# EasyEDA Pro project 超级电小鹅EDAv0.1.epro

# Schematic 超级电小鹅
Board Name: stm32桌面宠物最新板二合一; Create Date: 2025-02-21; Page Name: P1; Project Name: STM32智能桌面宠物; Schematic Name: 超级电小鹅; Update Date: 2025-02-21; Company: 嘉立创EDA; Drawed: SPICY_NOODLES; Page Size: A4; Version: V1.0
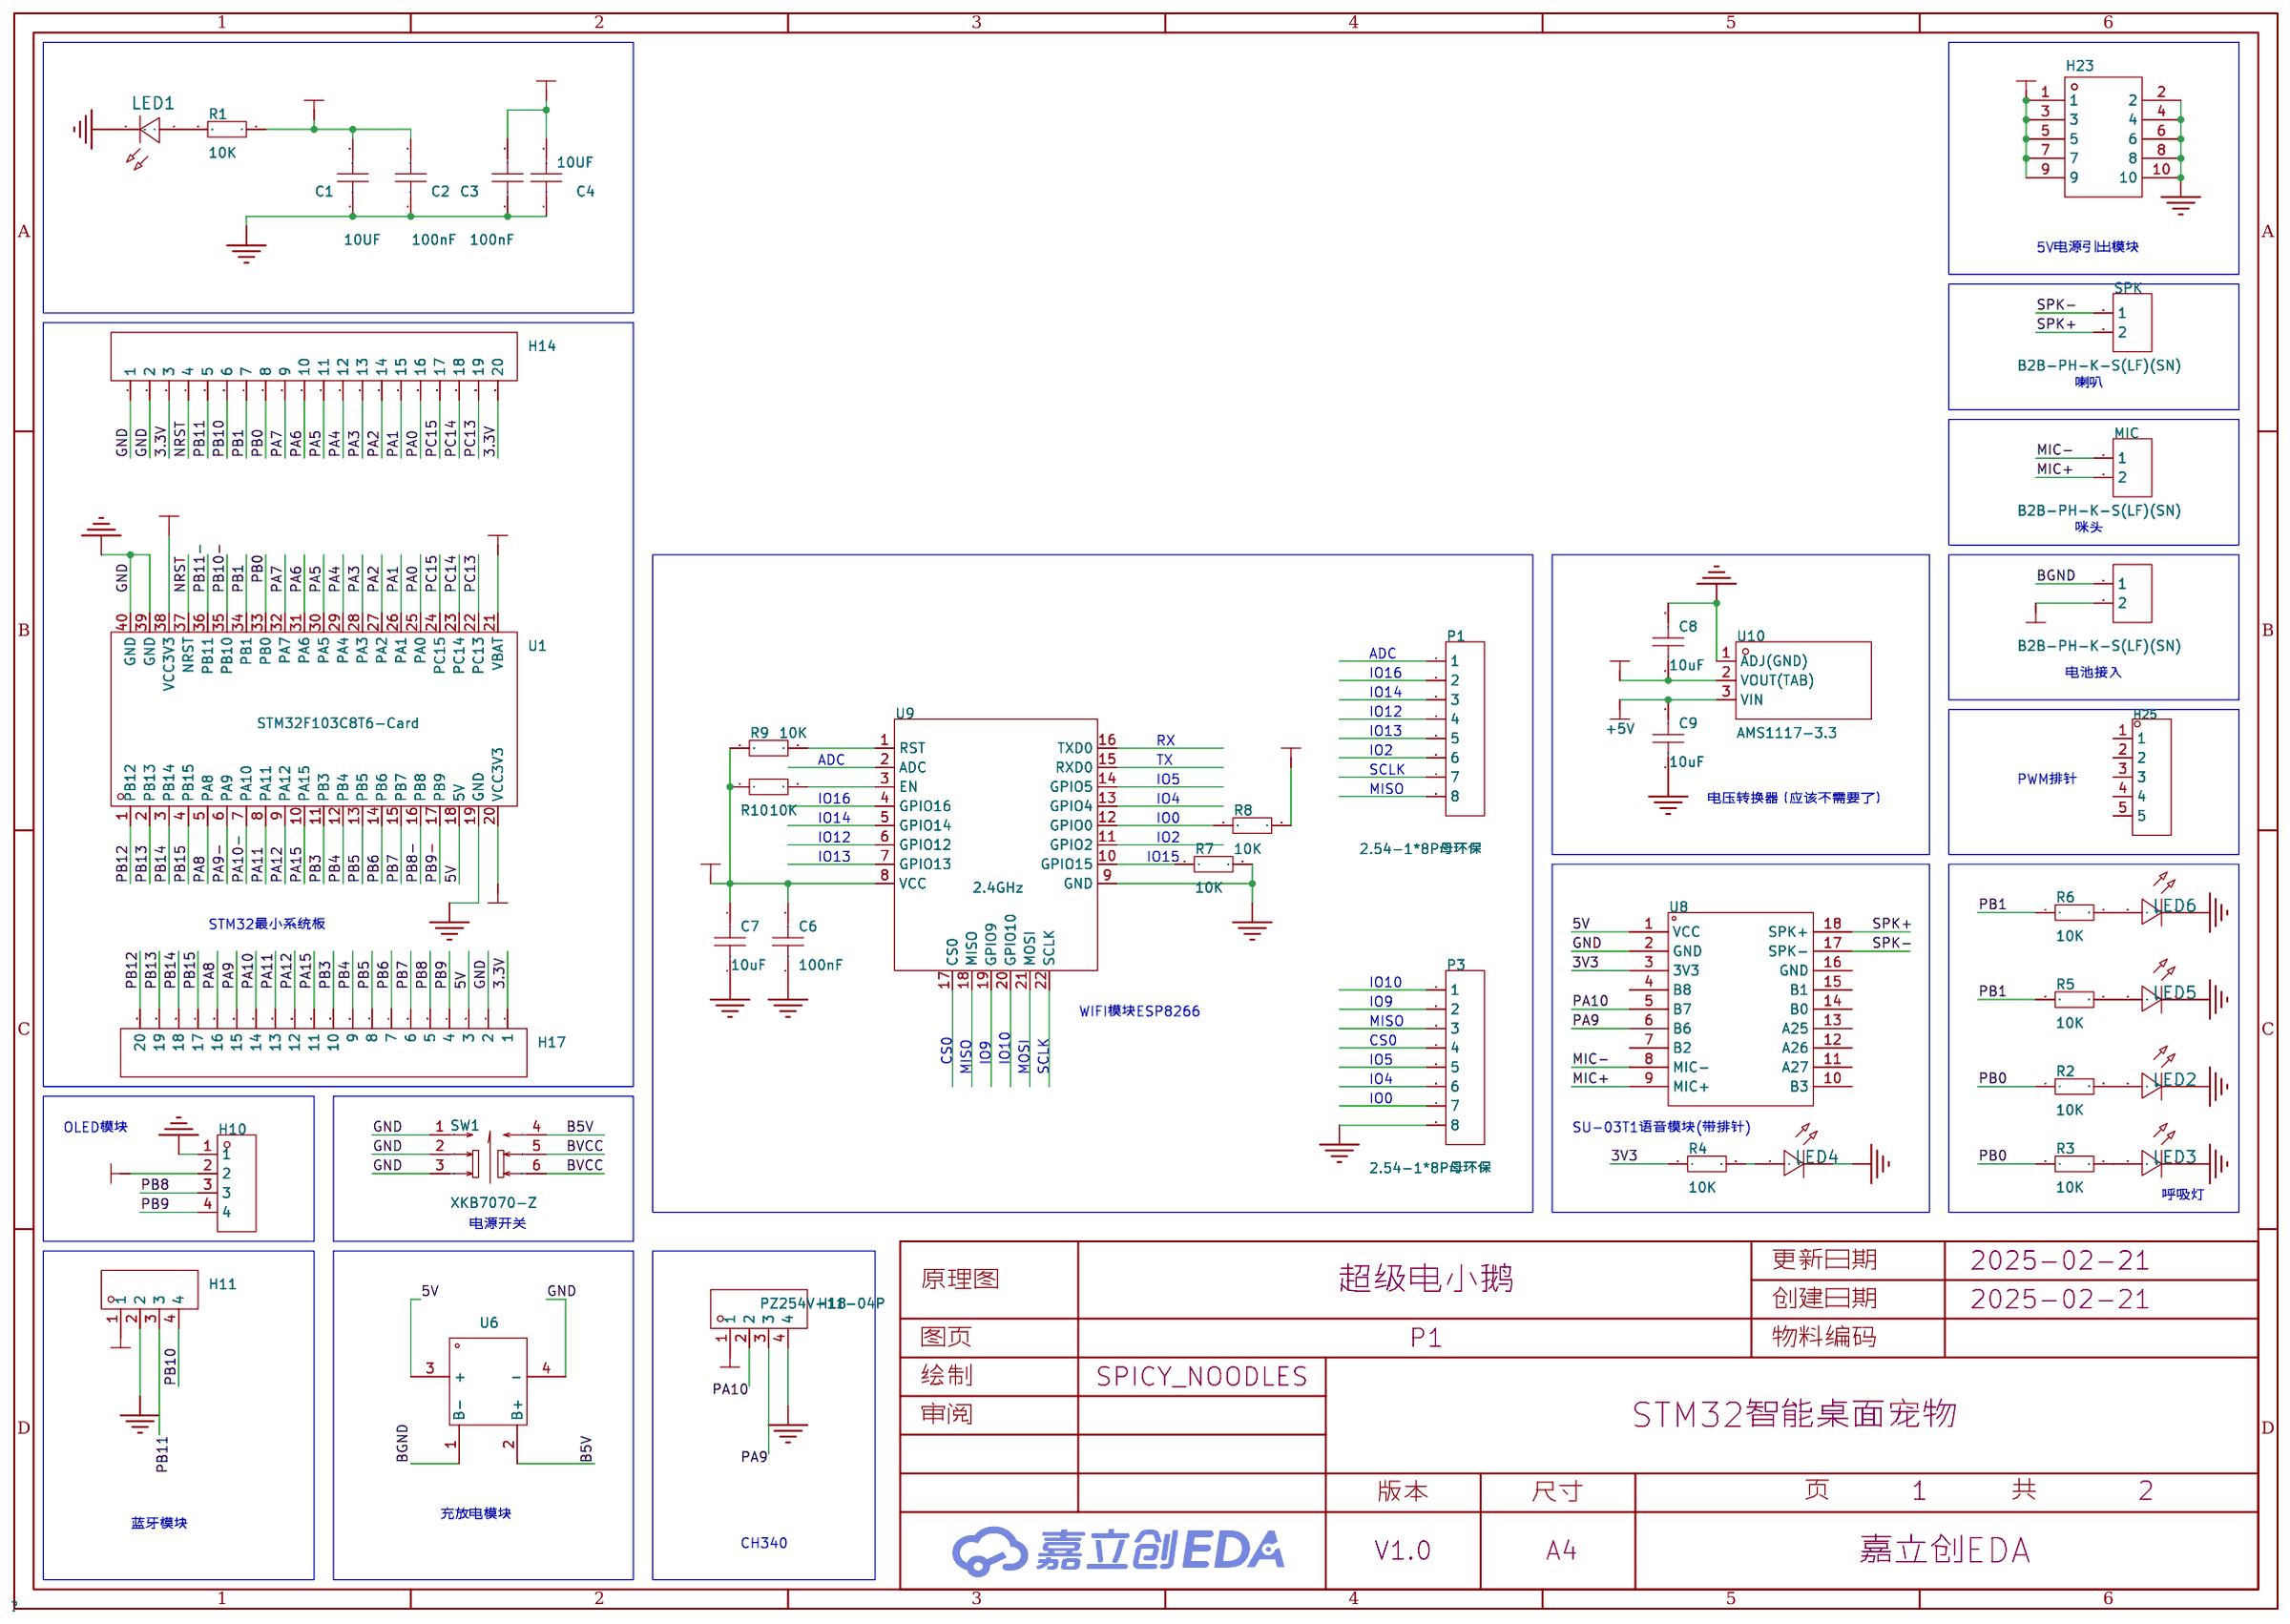
[diagram p0: schematic sheet]

## Parts
Battery  B2B-PH-K-S(LF)(SN)  [CONN-TH_B2B-PH-K-S]
C1  10UF  [C0805]
C2  100nF  [C0805]
C3  100nF  [C0805]
C4  10UF  [C0805]
C6  100nF  [C0603]
C7  10uF  [C0603]
C8  10uF  [C0603]
C9  10uF  [C0603]
H10  -  [HDR-TH_4P-P2.54-V-F]
H11  -  [HDR-TH_4P-P2.54-V-F]
H14  -  [HDR-TH_20P-P2.54-V-F]
H17  -  [HDR-TH_20P-P2.54-V-F]
H18  PZ254V-11-04P  [HDR-TH_4P-P2.54-V-M]
H23  -  [HDR-TH_10P-P2.54-V-M-R2-C5-S2.54]
H25  -  [HDR-TH_5P-P2.54-V-M]
LED1  -  [LED_0805]
LED2  -  [LED_0805]
LED3  -  [LED_0805]
LED4  -  [LED_0805]
LED5  -  [LED_0805]
LED6  -  [LED_0805]
MIC  B2B-PH-K-S(LF)(SN)  [CONN-TH_B2B-PH-K-S]
P1  2.54-1*8P母环保  [HDR-TH_8P-P2.54-V-F-1]
P3  2.54-1*8P母环保  [HDR-TH_8P-P2.54-V-F-1]
R1  10K  [R0805]
R2  10K  [R0805]
R3  10K  [R0805]
R4  10K  [R0805]
R5  10K  [R0805]
R6  10K  [R0805]
R7  10K  [R0603]
R8  10K  [R0603]
R9  10K  [R0603]
R10  10K  [R0603]
SPK  B2B-PH-K-S(LF)(SN)  [CONN-TH_B2B-PH-K-S]
SW1  XKB7070-Z  [SW-TH_6P-L7.0-W7.0-P2.00]
U1  STM32F103C8T6-Card  [CONN-TH_L53.3-W22.9_STM32F103C8T6-CARD]
U6  -  [充放电模块更新]
U8  -  [SU-03T带排针]
U9  2.4GHz  [WIFIM-SMD_ESP-12F-ESP8266MOD]
U10  AMS1117-3.3  [SOT-89_L4.5-W2.5-P1.50-LS4.2-BR]

## Library data of the parts
Battery MIC SPK = B2B-PH-K-S(LF)(SN): 插针结构:1x2P;间距:2mm;安装方式:直插;参考系列:PH;总PIN数:2P;排数:1;每排PIN数:2;行距:-;额定电流:2A;触头材质:黄铜;触头镀层:锡;工作温度范围:-25℃~+85℃;; LCSC Part Name: 1x2P 间距:2mm 直插 系列:PH; Supplier Part: C131337; Manufacturer: JST; Supplier Footprint: 插件,P=2mm; JLCPCB Part Class: Extended Part; Datasheet: https://atta.szlcsc.com/upload/public/pdf/source/20171026/C131342_15089839687311058815.pdf; Supplier: LCSC; Pins Structure: 1x2P; Pitch: 2mm; Mounting Style: 直插; Reference Series: PH; Number of Pins: 2P; Number of Rows: 1; Number of PINs Per Row: 2; Current Rating (Max): 2A; Contact Material: 黄铜; Contact Plating: 锡; Operating Temperature Range: -25℃~+85℃; Rated Voltage (Max): 100V; Plastic Material: PA66; Flame Retardant Rating: UL94V-0; Supplementary Features: 打K脚; Colour: 白色; Z-Height of the Board: 6mm; X-Length of Bottom Edge on Board (Spacing Line): 5.9mm; Y-Width of Bottom Edge on Board: 4.5mm
C1-C4 = CAP_0805: Supplier Footprint: 0805
C6 = CAP_0603: Supplier Footprint: 0603
C7-C9 = CGA0603X5R106K100JT: 容值:10uF;精度:±10%;额定电压:10V;材质(温度系数):X5R;; LCSC Part Name: 10uF ±10% 10V; Supplier Part: C6119842; Manufacturer: HRE(芯声); Supplier Footprint: 0603; JLCPCB Part Class: 扩展库; Supplier: LCSC; Tolerance: ±10%; Voltage Rated: 10V; Temperature Coefficient: X5R
H10 H11 = HDR-F_2.54_1x4P: Supplier Part: C2718488; Supplier Footprint: 插件
H14 H17 = HDR-F_2.54_1x20P: Supplier Part: C50984; Supplier Footprint: 插件
H18 = PZ254V-11-04P: 插针结构:1x4P;间距:2.54mm;行距:-;圆针/方针:方针;安装类型:直插;排数:单排;总PIN位数:4P;额定电流:3A;额定电压:250V;配合针长度:6mm;塑高:2.5mm;端接针长度:3mm;触头材质:-;工作温度范围:-40℃~+105℃;颜色:黑色;; LCSC Part Name: 间距:2.54mm 1x4P 直插 方针; Supplier Part: C2691448; Manufacturer: XFCN(兴飞); Supplier Footprint: 插件,P=2.54mm; JLCPCB Part Class: Extended Part; Datasheet: https://atta.szlcsc.com/upload/public/pdf/source/20200309/C492403_F9F19131791D08044AD4F84F8E751A34.pdf; Supplier: LCSC; Pin Structure: 1x4P; Pitch: 2.54mm; Circluar Pins/Square Pins: 方针; Mounting Type: 直插; Number of Rows: 单排; Number of Pins: 4P; Current Rating (Max): 3A; Voltage Rating (Max): 250V; Length of Mating Pin: 6mm; Insulation Height: 2.5mm; Length of End Connection Pin: 3mm; Operating Temperature Range: -40℃~+105℃; Color: 黑色
H23 = HDR-M_2.54_2x5: Supplier Part: C124387; Supplier Footprint: 插件,P=2.54mm
H25 = HDR-M_2.54_1x5P: Supplier Part: C358687; Supplier Footprint: 插件
LED1-LED6 = LED_0805-R: Supplier Footprint: 0805
P1 P3 = 2.54-1*8P母环保: 插孔结构:1x8P;间距:2.54mm;行距:-;安装类型:直插;排数:单排;总孔位数:8P;塑高:-;触头材质:-;触头镀层:-;; LCSC Part Name: 间距:2.54mm 1x8P 直插; Supplier Part: C27438; Manufacturer: BOOMELE(博穆精密); Supplier Footprint: 插件,P=2.54mm; JLCPCB Part Class: 扩展库; Datasheet: https://atta.szlcsc.com/upload/public/pdf/source/20231221/1CA800C6799ED97958773716FAA1BFFE.pdf; Supplier: LCSC; Holes Structure: 1x8P; Pitch: 2.54mm; Mounting Type: 直插; Number of Rows: 单排; Number of Holes: 8P
R1-R6 = Res_0805: Supplier Footprint: 0805
R7-R10 = Res_0603: Supplier Footprint: 0603
SW1 = XKB7070-Z: 自锁/无锁:自锁;安装方式:直插;触点电流:100mA;额定电压 (AC):250V;额定电压 (DC):30V;带灯:不带;作用力:160gf;机械寿命:10万次;; LCSC Part Name: 按键开关   7*7插件自锁 蓝白黑; Supplier Part: C318863; Manufacturer: XKB Connectivity(中国星坤); Supplier Footprint: 插件; JLCPCB Part Class: 扩展库; Datasheet: https://atta.szlcsc.com/upload/public/pdf/source/20211015/75A682A27A424BDE8D93C2CFA14C38FE.pdf; Supplier: LCSC; Self Lock / No Lock: 自锁; Actuator Style: 矩形按钮; Mounting Style: 直插; Contact Current: 100mA; Voltage Rating (AC): 250V; Voltage Rating (DC): 30V; Insulation Resistance: 100MΩ; Actuator/Cap Color: 蓝色; With Lamp: 不带; Pin Style: PC引脚; Operating Force: 160gf; Operating Temperature: -15℃~+55℃; Mechanical Life: 10万次
U1 = STM32F103C8T6-Card: Supplier Part: C9900077949; Supplier Footprint: 插件; Supplier: LCSC
U6 = 5V充放电模块
U8 = SU-03T带排针
U9 = ESP-12F(ESP8266MOD): 核心处理器:ESP8266芯片;频率:2.4GHz;天线形式:板载PCB天线;发射功率:16dBm;接收灵敏度:-90dBm;; LCSC Part Name: 完整的802.11b/g/nWi-FiSoC模块 屏蔽罩上的丝印是：ESP8266MOD，ESP8266EX串口WIFI; Supplier Part: C82891; Manufacturer: Ai-Thinker(安信可); Supplier Footprint: SMD,16x24mm; JLCPCB Part Class: 扩展库; Datasheet: https://atta.szlcsc.com/upload/public/pdf/source/20210219/C82891_ABD84A460F4F056A2757267CCCA4B508.pdf; Supplier: LCSC; Core Processor: ESP8266芯片; Support Interface: GPIO；UART；I2C；PWM；SPI；ADC; Antenna Type: 板载PCB天线; Output Power: 16dBm; Operating Voltage: 3.3V; Receive  Current: 120mA; Send  Current: 170mA; Sensitivity: -90dBm; Operating Temperature: -40℃~+85℃
U10 = AMS1117-3.3_C347256: 输出类型:固定;工作电压:18V;输出电压:3.3V;输出电流:1A;电源纹波抑制比(PSRR):60dB@(120Hz);输出极性:正极;; LCSC Part Name: 输出:3.3V 电流:1A 耐压:18V; Supplier Part: C347256; Manufacturer: UMW(友台半导体); Supplier Footprint: SOT-89; JLCPCB Part Class: 扩展库; Datasheet: https://atta.szlcsc.com/upload/public/pdf/source/20241218/BAF0263FA2E44BCD8AF41AA4FA04EFAA.pdf; Supplier: LCSC; Output Type: 固定; Voltage - Supply: 18V; Output Voltage: 3.3V; Output Current: 1A; Power Supply Rejection Ratio (PSRR): 60dB@(120Hz); Voltage Dropout: 1.3V@(1A); Features: 过流保护(OCP); Output Configuration: 正极; Number of Outputs: 1

## Nets
3.3V: C3.2 C4.2 C6.2 C7.2 C8.1 H10.2 H11.1 H14.3 H14.20 H17.1 R8.2 R9.1 R10.1 U1.20(VCC3V3) U1.21(VBAT) U1.38(VCC3V3) U9.8(VCC) U10.2(VOUT(TAB))
3V3: R4.1 U8.3(3V3)
5V: C1.2 C2.2 H17.3 H18.1 H23.1 H23.3 H23.5 H23.7 H23.9 R1.1 U1.18(5V) U6.3(+) U8.1(VCC)
+5V: C9.2 U10.3(VIN)
GND: C1.1 C2.1 C3.1 C4.1 C6.1 C7.1 C8.2 C9.1 H10.1 H11.2 H14.1 H14.2 H17.2 H18.4 H23.2 H23.4 H23.6 H23.8 H23.10 LED1.1(C) LED2.1(C) LED3.1(C) LED4.1(C) LED5.1(C) LED6.1(C) P3.8 R7.2 SW1.1 SW1.2 SW1.3 U1.19(GND) U1.39(GND) U1.40(GND) U6.4(-) U8.2(GND) U9.9(GND) U10.1(ADJ(GND))
B5V: SW1.4 U6.2(B+)
BGND: Battery.1 U6.1(B-)
BVCC: Battery.2 SW1.5 SW1.6
MIC+: MIC.2 U8.9(MIC+)
MIC-: MIC.1 U8.8(MIC-)
NRST: H14.4 U1.37(NRST)
PA0: H14.16 U1.25(PA0)
PA1: H14.15 U1.26(PA1)
PA2: H14.14 U1.27(PA2)
PA3: H14.13 U1.28(PA3)
PA4: H14.12 U1.29(PA4)
PA5: H14.11 U1.30(PA5)
PA6: H14.10 U1.31(PA6)
PA7: H14.9 U1.32(PA7)
PA8: H17.16 U1.5(PA8)
PA9: H17.15 H18.3 U8.6(B6)
PA9-: U1.6(PA9)
PA10: H17.14 H18.2 U8.5(B7)
PA10-: U1.7(PA10)
PA11: H17.13 U1.8(PA11)
PA12: H17.12 U1.9(PA12)
PA15: H17.11 U1.10(PA15)
PB0: H14.8 R2.1 R3.1 U1.33(PB0)
PB1: H14.7 R5.1 R6.1 U1.34(PB1)
PB3: H17.10 U1.11(PB3)
PB4: H17.9 U1.12(PB4)
PB5: H17.8 U1.13(PB5)
PB6: H17.7 U1.14(PB6)
PB7: H17.6 U1.15(PB7)
PB8: H10.3 H17.5
PB8-: U1.16(PB8)
PB9: H10.4 H17.4
PB9-: U1.17(PB9)
PB10: H11.4 H14.6
PB10-: U1.35(PB10)
PB11: H11.3 H14.5
PB11-: U1.36(PB11)
PB12: H17.20 U1.1(PB12)
PB13: H17.19 U1.2(PB13)
PB14: H17.18 U1.3(PB14)
PB15: H17.17 U1.4(PB15)
PC13: H14.19 U1.22(PC13)
PC14: H14.18 U1.23(PC14)
PC15: H14.17 U1.24(PC15)
SPK+: SPK.2 U8.18(SPK+)
SPK-: SPK.1 U8.17(SPK-)
$1N1622: LED1.2(A) R1.2
$1N9704: LED2.2(A) R2.2
$1N12766: LED3.2(A) R3.2
$1N14398: LED4.2(A) R4.2
$1N16652: LED5.2(A) R5.2
$1N16720: LED6.2(A) R6.2
$1N22432: R9.2 U9.1(RST)
$1N22482: R10.2 U9.3(EN)
$1N22550: R7.1 U9.10(GPIO15)
$1N22552: R8.1 U9.12(GPIO0)

Not connected (* = marked no-connect by the designer): H25 1 2 3 4 5; P1 1 2 3 4 5 6 7 8; P3 1 2 3 4 5 6 7; U8 4(B8) 7(B2) 10(B3) 11(A27) 12(A26) 13(A25) 14(B0) 15(B1) 16(GND); U9 2(ADC) 4(GPIO16) 5(GPIO14) 6(GPIO12) 7(GPIO13) 11(GPIO2) 13(GPIO4) 14(GPIO5) 15(RXD0) 16(TXD0) 17(CS0) 18(MISO) 19(GPIO9) 20(GPIO10) 21(MOSI) 22(SCLK)

## Notes on the sheet
- 5V电源引出模块
- 喇叭
- 咪头
- ADC
- IO16
- 电池接入
- IO14
- IO12
- RX
- IO13
- ADC
- TX
- IO2
- SCLK
- IO5
- MISO
- PWM排针
- IO16
- IO4
- 电压转换器（应该不需要了）
- IO12
- IO14
- IO0
- IO2
- IO13
- IO15
- STM32最小系统板
- IO10
- WIFI模块ESP8266
- IO9
- MISO
- CS0
- CS0
- IO9
- IO10
- IO5
- MISO
- MOSI
- SCLK
- IO4
- IO0
- OLED模块
- SU-03T1语音模块(带排针)
- 呼吸灯
- 电源开关
- 蓝牙模块
- 充放电模块
- CH340

# Board 超级电小鹅
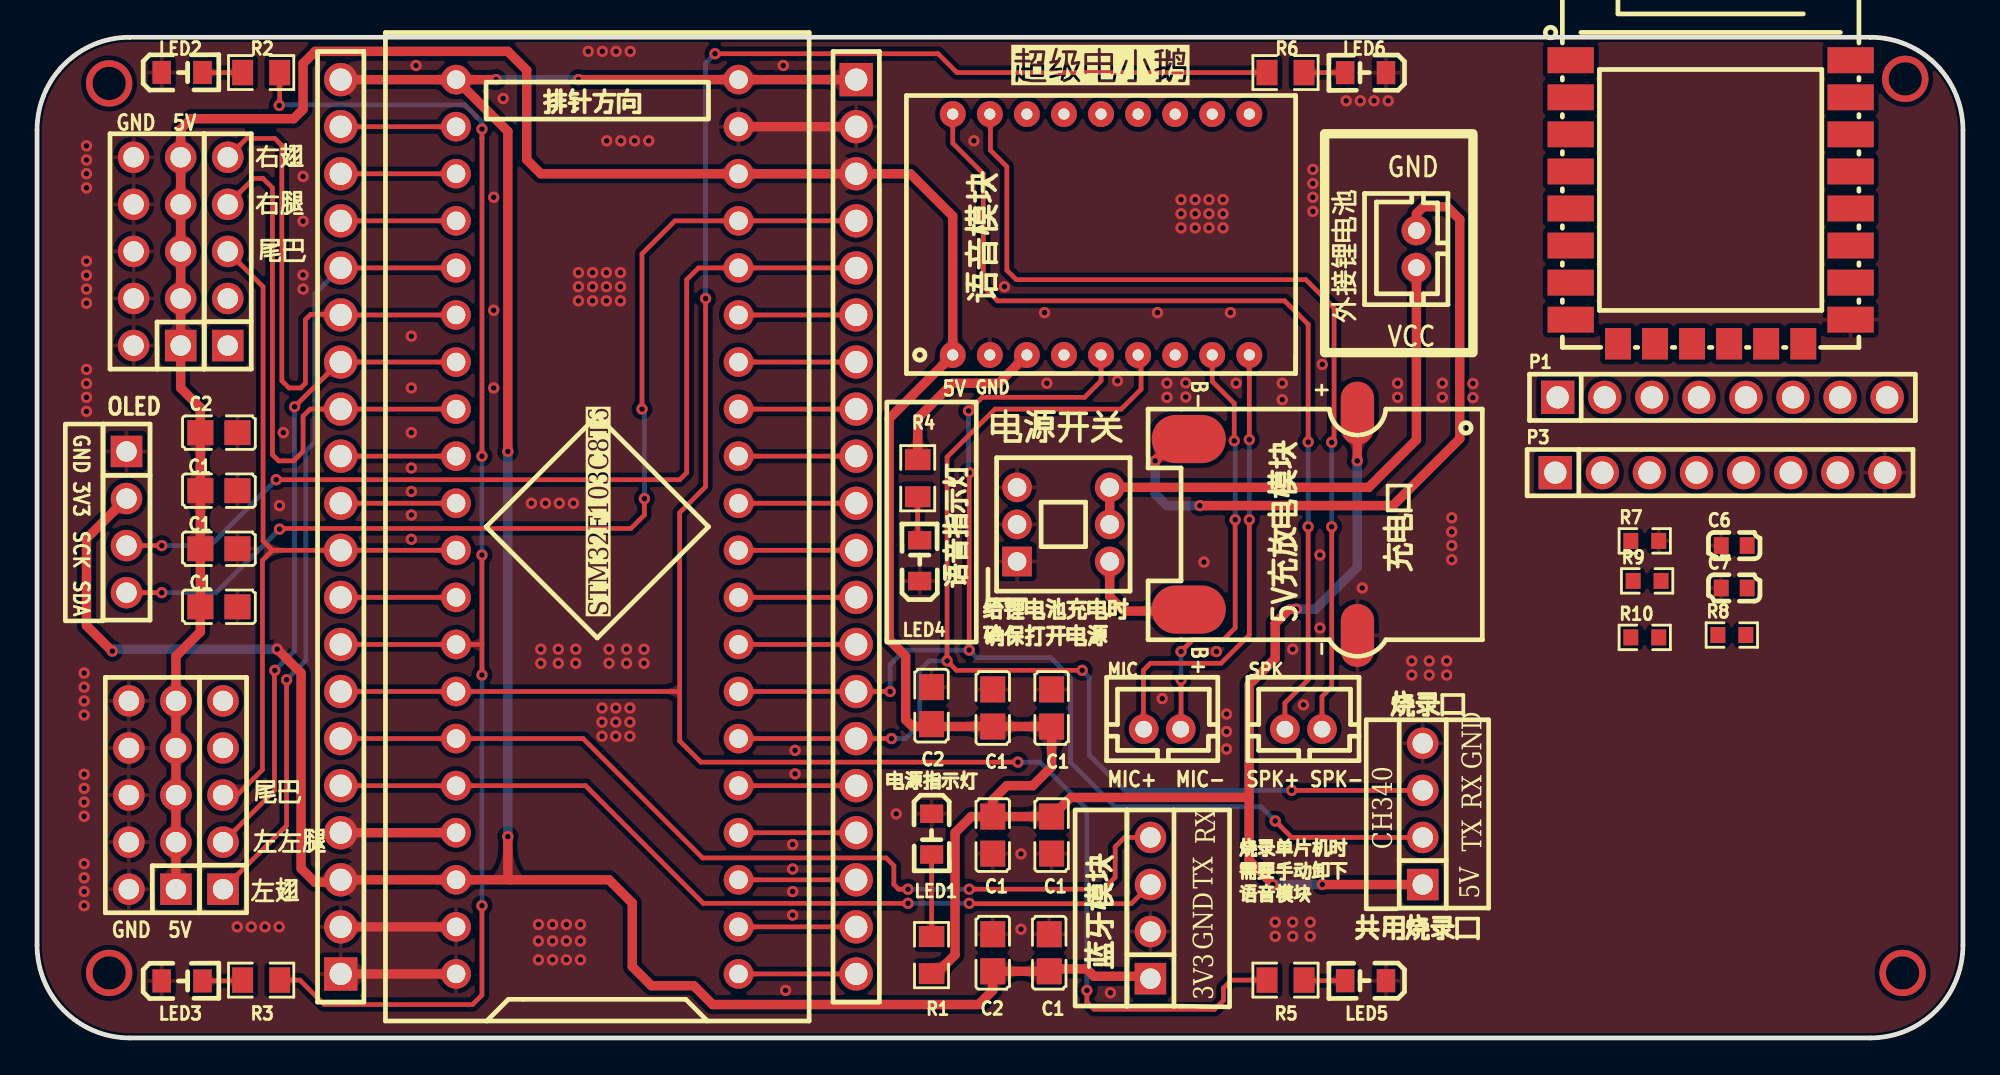
[diagram p1: board, top side]
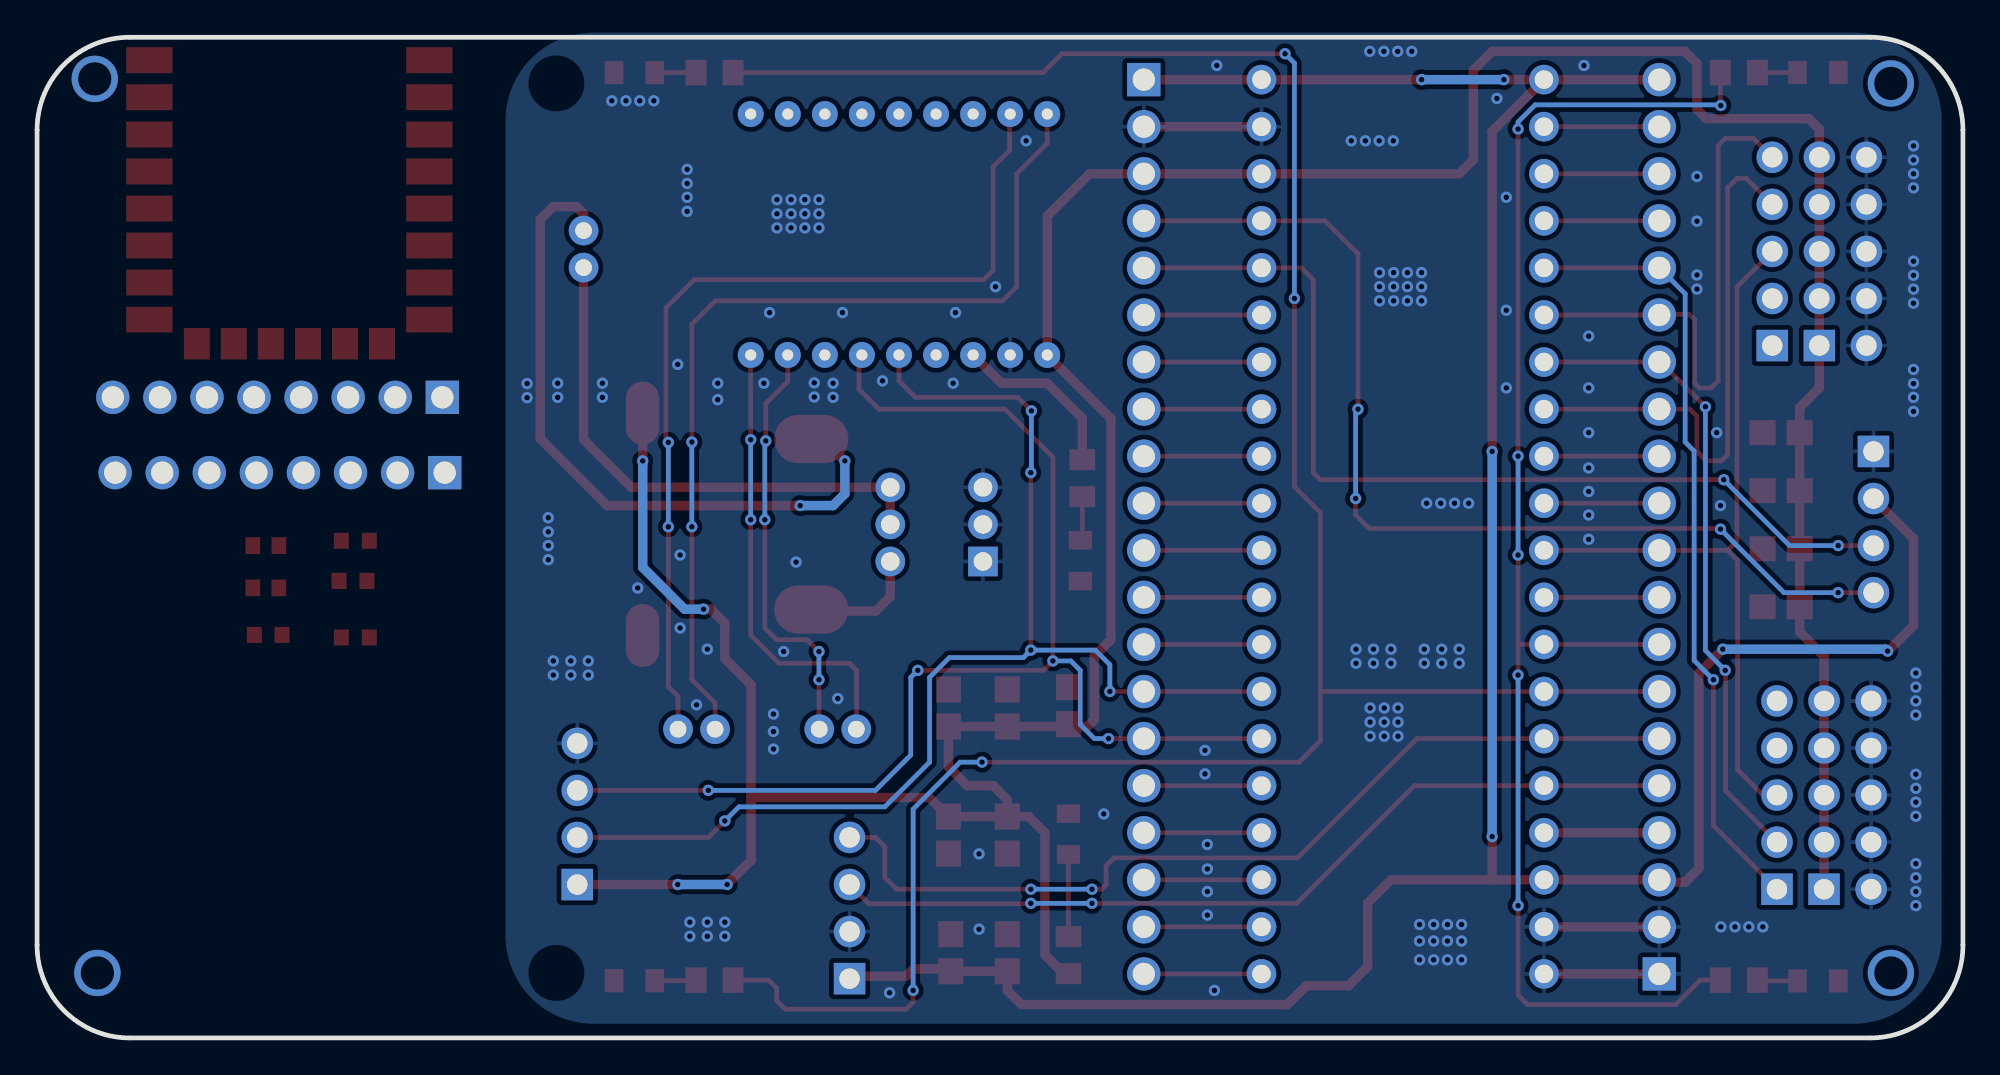
[diagram p2: board, bottom side, seen from below]

Outline 103.91 x 54 mm; copper layers: Top Layer, Bottom Layer. Coordinates in mm from the lower left corner of the outline.
Outline path: 0,49 0,5 arc(1.46,1.46) 5,0 98.91,0 arc(102.44,1.46) 103.91,5 103.91,49 arc(102.44,52.54) 98.91,54 5,54 arc(1.46,52.54) 0,49
Stack: Top Layer 0.035mm / Dielectric1 1.51mm FR4 er 4.5 / Bottom Layer 0.035mm

## Design rules (mm)
template: JLCPCB Capability(Two Layers Board)
spacing copperThickness1oz (default): track to track 0.102, other pairs 0.152 to 0.3
spacing copperThickness2oz: track to track 0.203, other pairs 0.152 to 0.3
track width copperThickness1oz (default): min 0.127, default 0.254, max 2.54
track width copperThickness2oz: min 0.203, default 0.254, max 2.54
differential pair differentialPair (default): width min 0.127, default 0.254, max 2.54; gap min 0.152, default 0.152
via viaSize (default): diameter min 0.5, default 0.61, max 10; hole min 0.3, default 0.305, max 6.3

## Placement (name value [footprint] x y rotation side)
C1  10UF  [C0805]  9.81 26.4 180 top
C1#2  -  [C0805]  51.56 10.95 90 top
C1#3  -  [C0805]  54.74 17.81 270 top
C1#4  -  [C0805]  54.61 4.6 270 top
C1#5  -  [C0805]  51.56 17.81 270 top
C1#6  -  [C0805]  9.81 29.53 180 top
C1#7  -  [C0805]  54.74 10.95 90 top
C1#8  -  [C0805]  9.81 23.27 180 top
C2  100nF  [C0805]  51.56 4.6 270 top
C2#2  -  [C0805]  48.26 17.93 270 top
C2#3  -  [C0805]  9.81 32.66 180 top
C6  100nF  [C0603]  91.57 26.57 0 top
C7  10uF  [C0603]  91.57 24.28 0 top
H10  -  [HDR-TH_4P-P2.54-V-F]  4.83 27.84 270 top
H11  -  [HDR-TH_4P-P2.54-V-F]  60.07 7.01 90 top
H14  -  [HDR-TH_20P-P2.54-V-F]  16.38 27.58 90 top
H17  -  [HDR-TH_20P-P2.54-V-F]  44.2 27.58 270 top
H18  PZ254V-11-04P  [HDR-TH_4P-P2.54-V-M]  74.76 12.09 90 top
H23  -  [HDR-TH_10P-P2.54-V-M-R2-C5-S2.54]  6.22 13.11 90 top
H23#2  -  [HDR-TH_10P-P2.54-V-M-R2-C5-S2.54]  6.48 42.44 90 top
H25  -  [HDR-TH_5P-P2.54-V-M]  10.29 42.44 90 top
H26  -  [HDR-TH_5P-P2.54-V-M]  10.03 13.11 90 top
LED1  -  [LED_0805]  48.26 10.95 270 top
LED2  -  [LED_0805]  7.87 52.1 0 top
LED3  -  [LED_0805]  7.87 3.07 0 top
LED4  -  [LED_0805]  47.62 25.81 90 top
LED5  -  [LED_0805]  71.63 3.09 180 top
LED6  -  [LED_0805]  71.63 52.1 180 top
MIC  B2B-PH-K-S(LF)(SN)  [CONN-TH_B2B-PH-K-S]  60.71 16.66 0 top
P1  2.54-1*8P母环保  [HDR-TH_8P-P2.54-V-F-1]  90.93 34.57 0 top
P3  2.54-1*8P母环保  [HDR-TH_8P-P2.54-V-F-1]  90.8 30.51 0 top
R1  10K  [R0805]  48.26 4.47 90 top
R2  10K  [R0805]  12.09 52.1 180 top
R3  10K  [R0805]  12.09 3.12 180 top
R4  10K  [R0805]  47.51 30.2 270 top
R5  10K  [R0805]  67.36 3.12 0 top
R6  10K  [R0805]  67.36 52.1 0 top
R7  10K  [R0603]  86.74 26.82 0 top
R8  10K  [R0603]  91.44 21.74 0 top
R9  10K  [R0603]  86.87 24.66 0 top
R10  10K  [R0603]  86.74 21.62 0 top
SPK  B2B-PH-K-S(LF)(SN)  [CONN-TH_B2B-PH-K-S]  68.33 16.66 0 top
SW1  XKB7070-Z  [SW-TH_6P-L7.0-W7.0-P2.00]  55.37 27.71 180 top
U1  STM32F103C8T6-Card  [CONN-TH_L53.3-W22.9_STM32F103C8T6-CARD]  30.23 27.58 90 top
U6  -  [充放电模块更新]  62.74 32.92 270 top
U8  -  [SU-03T带排针]  65.4 36.86 90 top
U9  2.4GHz  [WIFIM-SMD_ESP-12F-ESP8266MOD]  90.3 45.11 270 top
外接锂电池  B2B-PH-K-S(LF)(SN)  [CONN-TH_B2B-PH-K-S]  74.42 42.57 90 top

## Footprints (pads in the part's own frame, mm; a bottom-side part is the same pattern mirrored in y, then rotated)
C0603
  rect 0.8x0.9 smd: 1(-0.7,0) 2(0.7,0)
C0805
  rect 1.41x1.35 smd: 1(-1,0) 2(1,0)
CONN-TH_B2B-PH-K-S
  round 1.6 hole 0.9: 1(1,0) 2(-1,0)
CONN-TH_L53.3-W22.9_STM32F103C8T6-CARD
  round 1.6 hole 1: 1(-24.13,-7.62) 2(-21.59,-7.62) 3(-19.05,-7.62) 4(-16.51,-7.62) 5(-13.97,-7.62) 6(-11.43,-7.62) 7(-8.89,-7.62) 8(-6.35,-7.62) 9(-3.81,-7.62) 10(-1.27,-7.62) 11(1.27,-7.62) 12(3.81,-7.62) 13(6.35,-7.62) 14(8.89,-7.62) 15(11.43,-7.62) 16(13.97,-7.62) 17(16.51,-7.62) 18(19.05,-7.62) 19(21.59,-7.62) 20(24.13,-7.62) 21(24.13,7.62) 22(21.59,7.62) 23(19.05,7.62) 24(16.51,7.62) 25(13.97,7.62) 26(11.43,7.62) 27(8.89,7.62) 28(6.35,7.62) 29(3.81,7.62) 30(1.27,7.62) 31(-1.27,7.62) 32(-3.81,7.62) 33(-6.35,7.62) 34(-8.89,7.62) 35(-11.43,7.62) 36(-13.97,7.62) 37(-16.51,7.62) 38(-19.05,7.62) 39(-21.59,7.62) 40(-24.13,7.62)
HDR-TH_4P-P2.54-V-F
  rect 1.7x1.7 hole 1.1: 1(-3.81,0)
  round 1.7 hole 1.1: 2(-1.27,0) 3(1.27,0) 4(3.81,0)
HDR-TH_4P-P2.54-V-M
  rect 1.7x1.7 hole 1.1: 1(-3.81,0)
  round 1.7 hole 1.1: 2(-1.27,0) 3(1.27,0) 4(3.81,0)
HDR-TH_5P-P2.54-V-M
  rect 1.7x1.7 hole 1.1: 1(-5.08,0)
  round 1.7 hole 1.1: 2(-2.54,0) 3(0,0) 4(2.54,0) 5(5.08,0)
HDR-TH_8P-P2.54-V-F-1
  rect 1.8x1.8 hole 1.2: 1(-8.89,0)
  round 1.8 hole 1.2: 2(-6.35,0) 3(-3.81,0) 4(-1.27,0) 5(1.27,0) 6(3.81,0) 7(6.35,0) 8(8.89,0)
HDR-TH_10P-P2.54-V-M-R2-C5-S2.54
  rect 1.7x1.7 hole 1.1: 1(-5.08,-1.27)
  round 1.7 hole 1.1: 2(-5.08,1.27) 3(-2.54,-1.27) 4(-2.54,1.27) 5(0,-1.27) 6(0,1.27) 7(2.54,-1.27) 8(2.54,1.27) 9(5.08,-1.27) 10(5.08,1.27)
HDR-TH_20P-P2.54-V-F
  rect 1.8x1.8 hole 1.2: 1(-24.13,0)
  round 1.8 hole 1.2: 2(-21.59,0) 3(-19.05,0) 4(-16.51,0) 5(-13.97,0) 6(-11.43,0) 7(-8.89,0) 8(-6.35,0) 9(-3.81,0) 10(-1.27,0) 11(1.27,0) 12(3.81,0) 13(6.35,0) 14(8.89,0) 15(11.43,0) 16(13.97,0) 17(16.51,0) 18(19.05,0) 19(21.59,0) 20(24.13,0)
LED_0805
  rect 1x1.25 smd: 1(-1.15,0.005) 2(1.05,0.005)
R0603
  rect 0.806x0.864 smd: 1(-0.753,0) 2(0.753,0)
R0805
  rect 1.133x1.377 smd: 1(-1,0) 2(1,0)
SU-03T带排针
  round 1.4 hole 0.6: 1(0,16) 2(0,14) 3(0,12) 4(0,10) 5(0,8) 6(0,6) 7(0,4) 8(0,2) 9(0,0) 10(13,0) 11(13,2) 12(13,4) 13(13,6) 14(13,8) 15(13,10) 16(13,12) 17(13,14) 18(13,16)
SW-TH_6P-L7.0-W7.0-P2.00
  rect 1.6x1.6 hole 1: 1(2.499,2)
  round 1.6 hole 1: 2(2.5,0) 3(2.5,-2) 4(-2.5,2) 5(-2.5,0) 6(-2.5,-2)
WIFIM-SMD_ESP-12F-ESP8266MOD
  rect 1.4x2.5 smd: 1(-7.651,-7.551) 2(-5.651,-7.551) 3(-3.651,-7.551) 4(-1.651,-7.551) 5(0.349,-7.551) 6(2.349,-7.551) 7(4.349,-7.551) 8(6.349,-7.551) 9(6.349,7.548) 10(4.349,7.55) 11(2.349,7.551) 12(0.349,7.551) 13(-1.651,7.55) 14(-3.651,7.551) 15(-5.651,7.551) 16(-7.651,7.551)
  rect 1.7x1.4 smd: 17(7.651,-5) 18(7.649,-3.002) 19(7.649,-1.004) 20(7.649,0.998) 21(7.649,2.997) 22(7.651,4.997)
充放电模块更新
  oval 2.6x4 smd: 1(0.6,-0.6) 2(9.8,-0.6)
  oval 3.4x1.8 smd: 3(-0.8,8.5) 4(11.2,8.5)

## Nets
As in the schematic, except:
3.3V: C1#4.2 C2.2 C6.2 C7.2 H10.2 H11.1 H14.3 H14.20 H17.1 R8.2 R9.1 R10.1 U1.20 U1.21 U1.38 U9.8
5V: C1.2 C1#2.2 C1#3.2 C1#5.2 C1#6.2 C1#7.2 C1#8.2 C2#2.2 C2#3.2 H17.3 H18.1 H23.1 H23.3 H23.5 H23.7 H23.9 H23#2.1 H23#2.3 H23#2.5 H23#2.7 H23#2.9 R1.1 U1.18 U6.3 U8.1
GND: C1.1 C1#2.1 C1#3.1 C1#4.1 C1#5.1 C1#6.1 C1#7.1 C1#8.1 C2.1 C2#2.1 C2#3.1 C6.1 C7.1 H10.1 H11.2 H14.1 H14.2 H17.2 H18.4 H23.2 H23.4 H23.6 H23.8 H23.10 H23#2.2 H23#2.4 H23#2.6 H23#2.8 H23#2.10 LED1.1 LED2.1 LED3.1 LED4.1 LED5.1 LED6.1 P3.8 R7.2 SW1.1 SW1.2 SW1.3 U1.19 U1.39 U1.40 U6.4 U8.2 U9.9
BGND: U6.1 外接锂电池.1
BVCC: SW1.5 SW1.6 外接锂电池.2
PA0: H14.16 H26.1 U1.25
PA1: H14.15 H25.5 U1.26
PA2: H14.14 H26.2 U1.27
PA3: H14.13 H25.4 U1.28
PA6: H14.10 H25.3 H26.3 U1.31
PA9: H17.15 H18.3 U1.6 U8.6
PA10: H17.14 H18.2 U1.7 U8.5
PB8: H10.3 H17.5 U1.16
PB9: H10.4 H17.4 U1.17
PB10: H11.4 H14.6 U1.35
PB11: H11.3 H14.5 U1.36

Pads without a net: H25 1 2; H26 4 5; U8 4 7 10 11 12 13 14 15 16

## Via types
v1: diameter 2.5, hole 1.8, Top Layer to Bottom Layer, 4 vias
v2: diameter 0.61, hole 0.305, Top Layer to Bottom Layer, 237 vias

## Routing (per net, layer and track width the routed paths; a pad name or vN(x,y) marks a point on that pad's centre or on a via; arc(x,y) is an arc through that point)
3.3V: length 155.8
  Top Layer w0.508: 25.53,8.53 30.86,8.53 32.11,7.28 32.11,3.85 33.15,2.82 35.43,2.82 36.45,1.8 50.8,1.8 51.56,2.56 C2.2 C1#4.2 54.74,3.72 56.63,3.72 57.02,3.33 59.94,3.33 H11.1 ; 25.53,8.53 25.4,8.66 v2(25.4,10.87) ; 25.53,8.53 U1.38 H14.3 16.26,8.41 14.99,8.41 14.24,9.15 14.24,19.69 v2(12.95,20.98) ; U1.21 H14.20 ; U1.21 v2(24.77,51.71) ; U1.21 25.4,48.92 v2(25.4,31.65) ; H17.1 U1.20 v2(29.21,51.71) ; H10.2 2.67,26.95 2.67,22.25 4.04,20.88 v2(4.06,20.88)
  Bottom Layer w0.508: v2(24.77,51.71) v2(29.21,51.71) ; v2(12.95,20.98) 4.17,20.98 v2(4.06,20.88) ; v2(25.4,10.87) v2(25.4,31.65)
3V3: length 9.5
  Top Layer w0.508: U8.3 51.88,35.33 49.4,35.33 47.51,33.44 R4.1
5V: length 198.8
  Top Layer w0.508: v2(67.95,23.14) 67.56,23.14 66.8,22.38 66.8,20.47 65.39,19.06 65.39,12.98 ; C1#2.2 50.4,11.95 49.53,11.07 49.53,4.49 48.51,3.47 R1.1 ; C1#2.2 51.56,12.85 52.32,13.61 53.72,13.61 54.74,14.63 C1#3.2 C1#5.2 47.23,16.81 46.86,17.17 46.86,20.6 45.97,21.49 45.97,33.43 U8.1 49.4,44.35 47.12,46.63 H17.3 U1.18 27.18,46.63 26.42,47.4 26.42,52.22 25.4,53.24 15.01,53.24 14.35,52.58 14.35,50.11 13.84,49.61 8.31,49.61 7.75,49.05 H23#2.9 H23#2.7 H23#2.5 H23#2.3 H23#2.1 7.75,35.08 8.81,34.01 C2#3.2 C1#8.2 8.81,21.92 7.49,20.6 H23.9 H23.7 H23.5 H23.3 H23.1 ; C1#2.2 C1#7.2 55.77,12.98 65.39,12.98 ; 65.39,12.98 65.39,9.58 66.67,8.3 v2(66.67,8.28) ; H18.1 69.34,8.28 v2(69.34,8.28) ; v2(71.23,31.14) 71.23,32.91 71.24,32.92
  Bottom Layer w0.508: v2(66.67,8.28) v2(69.34,8.28) ; v2(67.95,23.14) 68.97,23.14 71.23,25.4 v2(71.23,31.14)
GND: length 18.8
  Top Layer w0.508: H14.1 U1.40 ; H14.2 U1.39 ; U1.19 H17.2
  vias: v2(2.54,19.69) v2(2.54,18.93) v2(2.54,18.19) v2(2.54,17.42) v2(2.54,14.23) v2(2.54,13.47) v2(2.54,12.73) v2(2.54,11.96) v2(2.54,9.4) v2(2.54,8.64) v2(2.54,7.9) v2(2.54,7.14) v2(2.67,48.14) v2(2.67,47.38) v2(2.67,46.63) v2(2.67,45.87) v2(2.67,41.92) v2(2.67,41.15) v2(2.67,40.41) v2(2.67,39.65) v2(2.67,36.07) v2(2.67,35.31) v2(2.67,34.57) v2(2.67,33.81) v2(10.8,5.99) v2(11.56,5.99) v2(12.3,5.99) v2(13.08,28.73) v2(13.06,5.99) v2(13.28,32.66) v2(14.35,46.49) v2(14.35,44.08) v2(14.35,41.17) v2(14.35,40.41) v2(20.19,37.87) v2(20.19,35.08) v2(20.19,32.66) v2(20.19,30.76) v2(20.19,29.49) v2(20.19,28.22) v2(20.19,26.91) v2(20.45,52.48) v2(24.64,45.36) v2(24.64,39.27) v2(24.64,35.08) v2(25.15,50.7) v2(26.67,28.85) v2(27.05,6.12) v2(27.05,5.23) v2(27.05,4.22) v2(27.18,20.98) v2(27.18,20.22) v2(27.43,28.85) v2(27.81,6.12) v2(27.81,5.23) v2(27.81,4.22) v2(28.12,20.98) v2(28.12,20.22) v2(28.18,28.85) v2(28.56,6.12) v2(28.56,5.23) v2(28.56,4.22) v2(28.94,28.85) v2(29.06,20.98) v2(29.06,20.22) v2(29.21,41.3) v2(29.21,40.54) v2(29.21,39.78) v2(29.32,6.12) v2(29.32,5.23) v2(29.32,4.22) v2(29.74,53.24) v2(29.97,41.3) v2(29.97,40.54) v2(29.97,39.78) v2(30.5,53.24) v2(30.48,17.81) v2(30.48,17.04) v2(30.48,16.28) v2(30.73,48.41) v2(30.72,41.3) v2(30.72,40.54) v2(30.72,39.78) v2(30.86,20.98) v2(30.86,20.22) v2(31.22,17.81) v2(31.22,17.04) v2(31.22,16.28) v2(31.24,53.24) v2(31.5,48.41) v2(31.48,41.3) v2(31.48,40.54) v2(31.48,39.78) v2(31.8,20.98) v2(31.8,20.22) v2(32,53.24) v2(31.99,17.81) v2(31.99,17.04) v2(31.99,16.28) v2(32.24,48.41) v2(32.75,20.98) v2(32.75,20.22) v2(33,48.41) v2(40.26,52.48) v2(40.39,2.56) v2(40.77,10.44) v2(40.77,9.12) v2(40.77,7.9) v2(40.77,6.63) v2(40.89,15.52) v2(40.89,14.25) v2(46.36,12.09) v2(50.55,48.41) v2(52.2,40.54) v2(53.09,9.93) v2(53.09,5.87) v2(54.36,39.14) v2(54.48,35.33) v2(57.91,2.44) v2(58.29,35.46) v2(60.45,39.14) v2(60.71,18.31) v2(60.96,35.33) v2(60.96,34.57) v2(61.72,45.24) v2(61.72,44.48) v2(61.72,43.71) v2(61.98,35.35) v2(61.98,34.59) v2(62.48,45.24) v2(62.48,44.48) v2(62.48,43.71) v2(62.96,25.68) v2(63.23,45.24) v2(63.23,44.48) v2(63.23,43.71) v2(63.63,20.85) v2(63.99,45.24) v2(63.99,44.48) v2(63.99,43.71) v2(64.18,17.48) v2(64.18,16.54) v2(64.18,15.59) v2(64.39,39.14) v2(64.69,35.33) v2(66.8,6.25) v2(66.8,5.49) v2(67.18,35.33) v2(67.18,34.44) v2(67.75,20.98) v2(67.75,6.25) v2(67.75,5.49) v2(68.33,17.98) v2(68.69,6.25) v2(68.69,5.49) v2(68.83,46.87) v2(68.83,46.11) v2(68.83,45.36) v2(68.83,44.6) v2(69.21,26.06) v2(69.21,22.12) v2(69.34,36.35) v2(70.63,50.57) v2(71.39,50.57) v2(71.5,24.28) v2(72.14,50.57) v2(72.9,50.57) v2(73.41,35.33) v2(73.41,34.57) v2(74.17,20.35) v2(74.17,19.58) v2(75.11,20.35) v2(75.11,19.58) v2(75.82,35.33) v2(75.82,34.57) v2(76.05,20.35) v2(76.05,19.58) v2(76.33,28.07) v2(76.33,27.31) v2(76.33,26.57) v2(76.33,25.81) v2(77.47,35.31) v2(77.47,34.55)
(no net):
  vias: v1(3.89,51.51) v1(3.89,3.51) v1(100.65,3.51) v1(100.8,51.75)
B5V: length 6.4
  Top Layer w0.508: SW1.4 57.87,23.81 58.65,23.04 62.06,23.04
BGND: length 38.6
  Top Layer w0.508: 62.94,32.32 U6.1 61.5,32.32 v2(60.33,31.14) ; 外接锂电池.1 74.42,44.48 74.8,44.86 76.07,44.86 76.76,44.17 76.76,32.33 73.15,28.73 v2(62.74,28.73)
  Bottom Layer w0.508: v2(62.74,28.73) 60.96,28.73 60.33,29.36 v2(60.33,31.14)
BVCC: length 28.9
  Top Layer w0.508: 外接锂电池.2 74.42,32.28 71.85,29.71 SW1.6 SW1.5
MIC+: length 24.8
  Top Layer w0.254: v2(65.4,32.28) U8.9 ; MIC.2 59.71,17.04 59.69,17.06 59.69,19.84 60.07,20.22 63.88,20.22 65.4,21.74 v2(65.4,27.97)
  Bottom Layer w0.254: v2(65.4,27.97) v2(65.4,32.28)
MIC-: length 22.9
  Top Layer w0.254: v2(64.64,27.97) 64.64,22.12 64.01,21.49 62.36,21.49 v2(61.72,20.85) ; MIC.1 61.72,16.68 v2(61.72,19.33) ; 63.4,36.85 63.4,35.43 64.59,34.24 v2(64.59,32.22)
  Bottom Layer w0.254: v2(64.59,32.22) 64.64,32.17 v2(64.64,27.97) ; v2(61.72,20.85) v2(61.72,19.33)
NRST: length 6.2
  Top Layer w0.508: H14.4 U1.37
PA0: length 42.4
  Top Layer w0.254: U1.25 H14.16 ; H26.1 13.46,11.46 v2(13.46,19.33)
  Bottom Layer w0.254: v2(13.46,19.33) 14.5,20.37 14.5,31.67 14.99,32.16 14.99,40.16 H14.16
PA1: length 29.4
  Top Layer w0.254: U1.26 H14.15 16.26,39.01 16.22,39.05 14.77,39.05 14.48,38.76 14.48,35.33 14.22,35.08 13.59,35.08 13.21,35.46 13.21,48.16 12.83,48.54 11.3,48.54 H25.5
PA2: length 34.8
  Top Layer w0.254: v2(13.89,34.06) 16.31,36.47 H14.14 U1.27 ; H26.2 12.81,13.34 12.81,19.82 v2(12.83,19.84)
  Bottom Layer w0.254: v2(13.89,34.06) 13.89,20.9 v2(12.83,19.84)
PA3: length 29.9
  Top Layer w0.254: H25.4 11.68,46.38 12.19,46.38 12.7,45.87 12.7,31.47 13.03,31.14 13.84,31.14 14.35,31.65 14.35,33.55 14.73,33.93 H14.13 U1.28
PA4: length 6.2
  Top Layer w0.254: U1.29 H14.12
PA5: length 6.2
  Top Layer w0.254: U1.30 H14.11
PA6: length 41.8
  Top Layer w0.254: H26.3 10.8,13.11 12.16,14.47 12.16,25.77 12.7,26.31 ; U1.31 H14.10 12.7,26.31 ; 12.7,26.31 12.19,26.82 12.19,40.54 H25.3
PA7: length 6.2
  Top Layer w0.254: U1.32 H14.9
PA8: length 6.3
  Top Layer w0.254: U1.5 H17.16
PA9: length 70.6
  Top Layer w0.254: v2(67.69,13.36) 67.69,13.36 H18.3 ; v2(56.39,19.84) 49.61,19.84 v2(49.1,20.35) 49.1,31.34 51.69,33.93 58.5,33.93 59.56,35 59.56,36.7 U8.6 ; v2(46.1,16.15) H17.15 U1.6
  Bottom Layer w0.254: v2(46.1,16.15) 46.86,16.15 47.62,16.92 47.62,19.84 48.13,20.35 v2(49.1,20.35) ; v2(56.39,19.84) 56.77,19.46 56.77,15.27 58.67,13.36 v2(67.69,13.36)
PA10: length 67.7
  Top Layer w0.254: v2(50.26,33.84) 50.99,34.57 56.52,34.57 57.4,35.46 U8.5 ; v2(46.02,18.69) H17.14 U1.7 ; H18.2 74.76,10.82 67.69,10.82 v2(66.8,11.71) ; v2(50.29,30.51) v2(50.29,20.93)
  Bottom Layer w0.254: v2(50.26,33.84) 50.26,30.54 v2(50.29,30.51) ; v2(46.02,18.69) 46.02,20.14 46.81,20.93 v2(50.29,20.93) 50.7,20.52 54.68,20.52 55.75,19.46 55.75,14.88 58.17,12.47 66.04,12.47 v2(66.8,11.71)
PA11: length 6.3
  Top Layer w0.254: U1.8 H17.13
PA12: length 6.3
  Top Layer w0.254: U1.9 H17.12
PA15: length 6.3
  Top Layer w0.254: U1.10 H17.11
PB0: length 79.5
  Top Layer w0.254: v2(24,19.58) 24,21.23 ; 24,21.23 v2(24,26.06) ; 24,21.23 U1.33 H14.8 ; v2(13.06,50.32) 13.09,50.34 R2.1 ; v2(24,31.39) 24.01,31.4 24.01,48.54 24,48.54 v2(24,49.05) ; v2(24,7.14) 24,2.31 23.49,1.8 15.49,1.8 14.18,3.12 R3.1
  Bottom Layer w0.254: v2(13.06,50.32) 13.1,50.35 23.08,50.35 24,49.43 v2(24,49.05) ; v2(24,31.39) v2(24,26.06) ; v2(24,7.14) v2(24,19.58)
PB1: length 131.2
  Top Layer w0.254: v2(36.07,39.9) 36.07,29.74 34.67,28.35 34.67,18.69 ; v2(36.58,53.11) 48.61,53.11 49.63,52.1 R6.1 ; 34.67,18.69 U1.34 H14.7 ; 34.67,18.69 34.67,16.03 35.81,14.88 v2(52.92,14.88) ; R5.1 64.44,3.12 64.01,2.69 64.01,2.02 63.53,1.55 57.02,1.55 56.64,1.93 v2(56.64,2.56)
  Bottom Layer w0.254: v2(36.58,53.11) 36.07,52.6 v2(36.07,39.9) ; v2(52.92,14.88) 54.1,14.88 56.64,12.34 v2(56.64,2.56)
PB3: length 6.3
  Top Layer w0.254: U1.11 H17.10
PB4: length 6.3
  Top Layer w0.254: U1.12 H17.9
PB5: length 6.3
  Top Layer w0.254: U1.13 H17.8
PB6: length 6.3
  Top Layer w0.254: U1.14 H17.7
PB7: length 6.3
  Top Layer w0.254: U1.15 H17.6
PB8: length 51.7
  Top Layer w0.254: H10.3 v2(6.73,26.57) ; H17.5 U1.16 35.69,41.55 35.05,40.92 35.05,30.51 34.67,30.12 v2(12.9,30.12)
  Bottom Layer w0.254: v2(12.9,30.12) 9.35,26.57 v2(6.73,26.57)
PB9: length 56.1
  Top Layer w0.254: v2(13.08,27.46) 13.12,27.49 32.04,27.49 32.77,28.22 v2(32.77,29.11) ; v2(32.64,33.93) 32.64,42.32 34.42,44.09 U1.17 H17.4 ; H10.4 v2(6.73,24.03)
  Bottom Layer w0.254: v2(32.77,29.11) 32.77,33.81 v2(32.64,33.93) ; v2(13.08,27.46) 9.65,24.03 v2(6.73,24.03)
PB10: length 49.8
  Top Layer w0.254: H11.4 58.67,10.82 58.17,10.31 58.17,8.66 57.53,8.03 v2(50.29,8.03) ; v2(46.99,8.03) 46.48,8.03 46.23,8.28 46.23,9.3 45.81,9.71 35.9,9.71 29.46,16.15 U1.35 H14.6
  Bottom Layer w0.254: v2(46.99,8.03) v2(50.29,8.03)
PB11: length 46.8
  Top Layer w0.254: v2(46.99,7.26) 35.94,7.26 29.59,13.61 U1.36 H14.5 ; v2(50.29,7.26) 50.31,7.24 59.03,7.24 H11.3
  Bottom Layer w0.254: v2(46.99,7.26) v2(50.29,7.26)
PB12: length 6.3
  Top Layer w0.254: U1.1 H17.20
PB13: length 6.3
  Top Layer w0.254: U1.2 H17.19
PB14: length 6.3
  Top Layer w0.254: U1.3 H17.18
PB15: length 6.3
  Top Layer w0.254: U1.4 H17.17
PC13: length 6.2
  Top Layer w0.254: U1.22 H14.19
PC14: length 6.2
  Top Layer w0.254: U1.23 H14.18
PC15: length 6.2
  Top Layer w0.254: U1.24 H14.17
SPK+: length 50.7
  Top Layer w0.254: SPK.2 67.33,18.08 68.58,19.33 v2(68.58,27.58) ; v2(68.58,32.16) 68.58,38.51 67.31,39.78 51.82,39.78 51.05,40.54 51.05,46.63 49.4,48.28 U8.18
  Bottom Layer w0.254: v2(68.58,32.16) v2(68.58,27.58)
SPK-: length 50.3
  Top Layer w0.254: v2(69.85,27.58) 69.85,18.95 69.33,18.42 SPK.1 ; U8.17 51.43,49.83 51.43,47.9 52.32,47.02 52.32,41.43 52.83,40.92 68.45,40.92 69.98,39.4 69.98,32.27 v2(69.85,32.14)
  Bottom Layer w0.254: v2(69.85,32.14) v2(69.85,27.58)
$1N1622: length 4.4
  Top Layer w0.254: LED1.2 48.27,5.48 R1.2
$1N9704: length 2.2
  Top Layer w0.254: LED2.2 8.93,52.1 R2.2
$1N12766: length 2.5
  Top Layer w0.254: LED3.2 10.79,3.08 11.05,3.33 11.05,3.16 R3.2
$1N14398: length 2.4
  Top Layer w0.254: R4.2 47.51,26.96 LED4.2
$1N16652: length 2.3
  Top Layer w0.254: R5.2 68.39,3.09 LED5.2 70.58,3.07
$1N16720: length 2.2
  Top Layer w0.254: LED6.2 70.57,52.1 R6.2

## Copper pours and planes (outline as drawn; the poured copper is in the pictures)
GND on Top Layer: -3.81,59.84 104.14,59.84 104.14,-3.66 -3.81,-3.66
GND on Bottom Layer: -7.11,60.35 99.44,60.35 99.44,-6.45 -7.11,-6.45

Small or netless copper shapes (teardrops, artwork), in the pictures only: 228 on Top Layer, 53 on Bottom Layer

## Text on the board
Top Silkscreen Layer: GND | MIC+ | MIC- | SPK+ | SPK- | + | - | 3V3 | SCK | SDA | B- | 5V | B+ | OLED | VCC | 超级电小鹅 | 左翅 | 尾巴 | 左左腿 | 右翅 | 右腿 | 排针方向 | STM32F103C8T6 | TX | RX | CH340 | 烧录单片机时 / 需要手动卸下 / 语音模块 | 电源指示灯 | 给锂电池充电时 / 确保打开电源 | 语音指示灯 | 共用烧录口 | 烧录口 | 蓝牙模块 | 电源开关 | 5V充放电模块 | 充电口 | 语音模块
